# EAGLE design Pedal board (EAGLE 9.4.2)

## Sheet 1 of 5
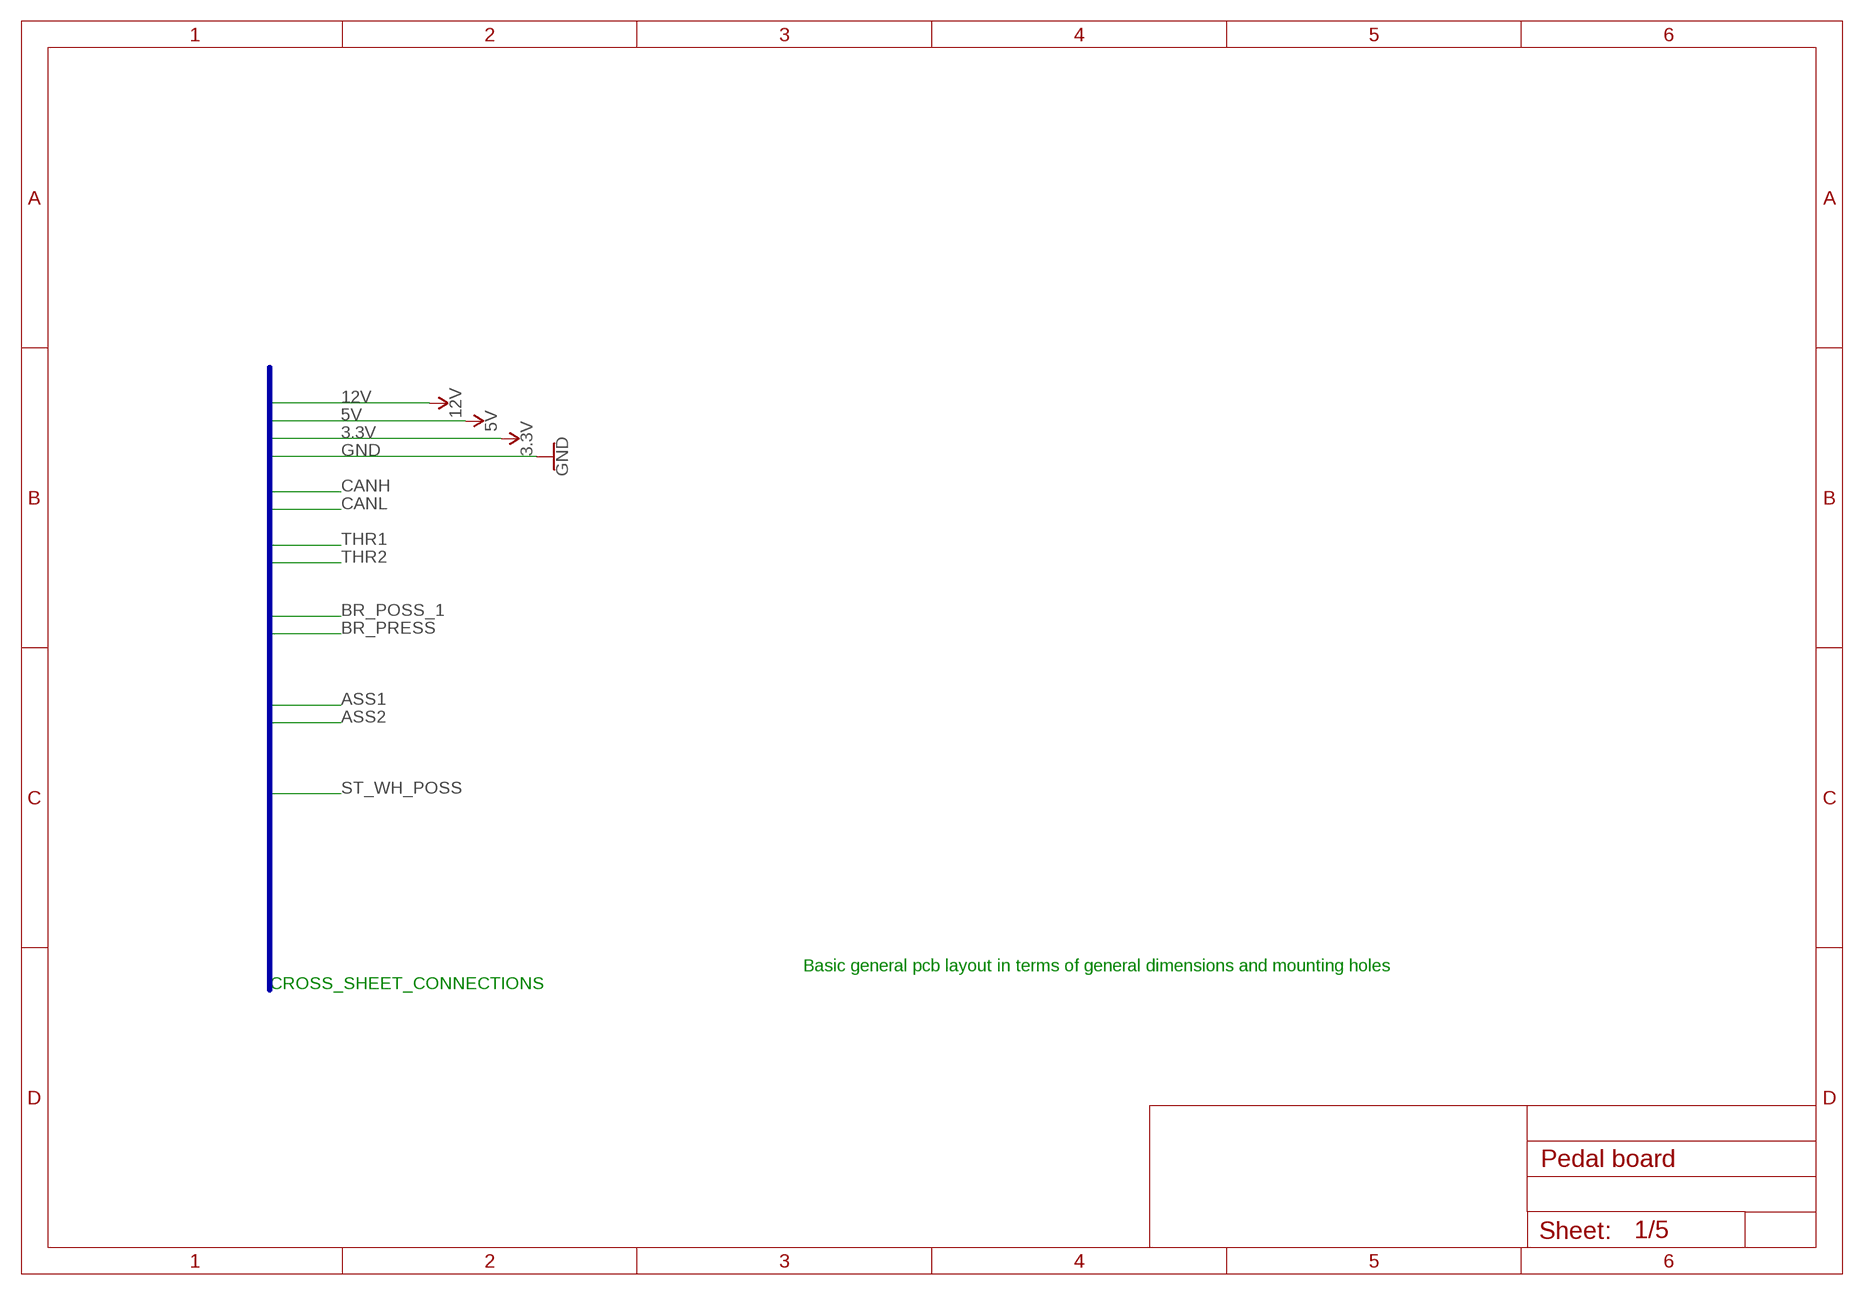
[diagram p0: schematic, sheet 1]

### Buses
3.3V,5V,12V,ASS1,ASS2,BATT_CURRENT,BRAKE_LIGHTS_OUT,BR_POSS,BR_PRESS,CANH,CANL,GND,ST_WH_POSS,THR1,THR2,THR3

### Notes on the sheet
- Basic general pcb layout in terms of general dimensions and mounting holes
- CROSS_SHEET_CONNECTIONS

## Sheet 2 of 5: INPUTS
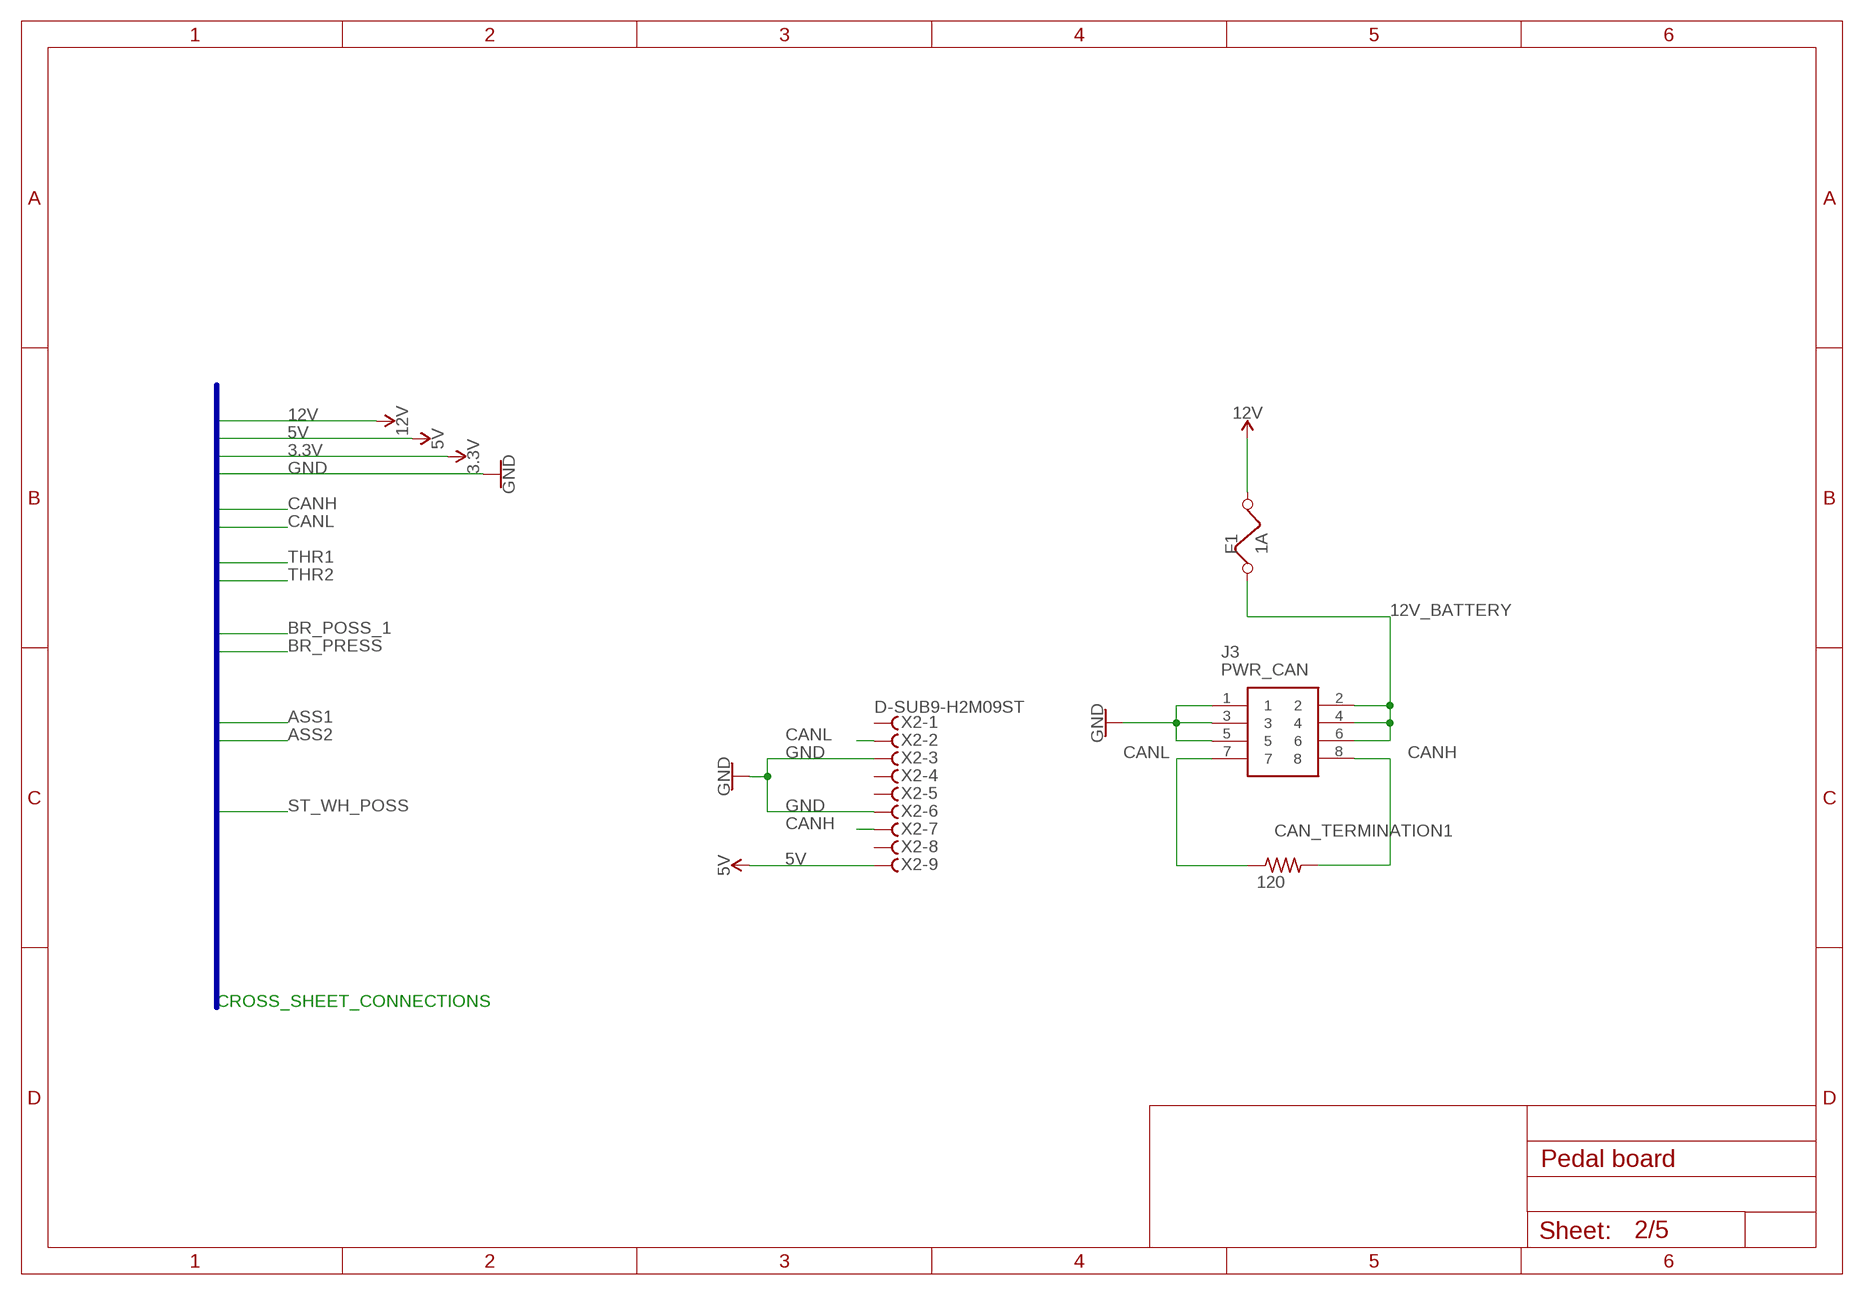
[diagram p1: schematic, sheet 2]

### Parts
CAN_TERMINATION1  120  R-US_R0805  [R0805]
F1  1A  FUSE  [FUSE]
J3  PWR_CAN  T821108A1S100CEU  [HDRV8W64P254_2X4_1778X895X915P]
X2  D-SUB9-H2M09ST  [H2M09ST]

### Nets
5V: X2.9 ; also sheet 1,3,4,5
12V: F1.2 ; also sheet 1,3,4,5
12V_BATTERY: F1.1 J3.2 J3.4 J3.6
CANH: CAN_TERMINATION1.2 J3.8 X2.7 ; also sheet 1,3,4,5
CANL: CAN_TERMINATION1.1 J3.7 X2.2 ; also sheet 1,3,4,5
GND: J3.1 J3.3 J3.5 X2.3 X2.6 ; also sheet 1,3,4,5
Unconnected: X2.1 X2.4 X2.5 X2.8

### Buses
3.3V,5V,12V,ASS1,ASS2,BATT_CURRENT,BRAKE_LIGHTS_OUT,BR_POSS,BR_PRESS,CANH,CANL,GND,ST_WH_POSS,THR1,THR2,THR3

### Notes on the sheet
- CROSS_SHEET_CONNECTIONS

## Sheet 3 of 5: POWER DELIVERY
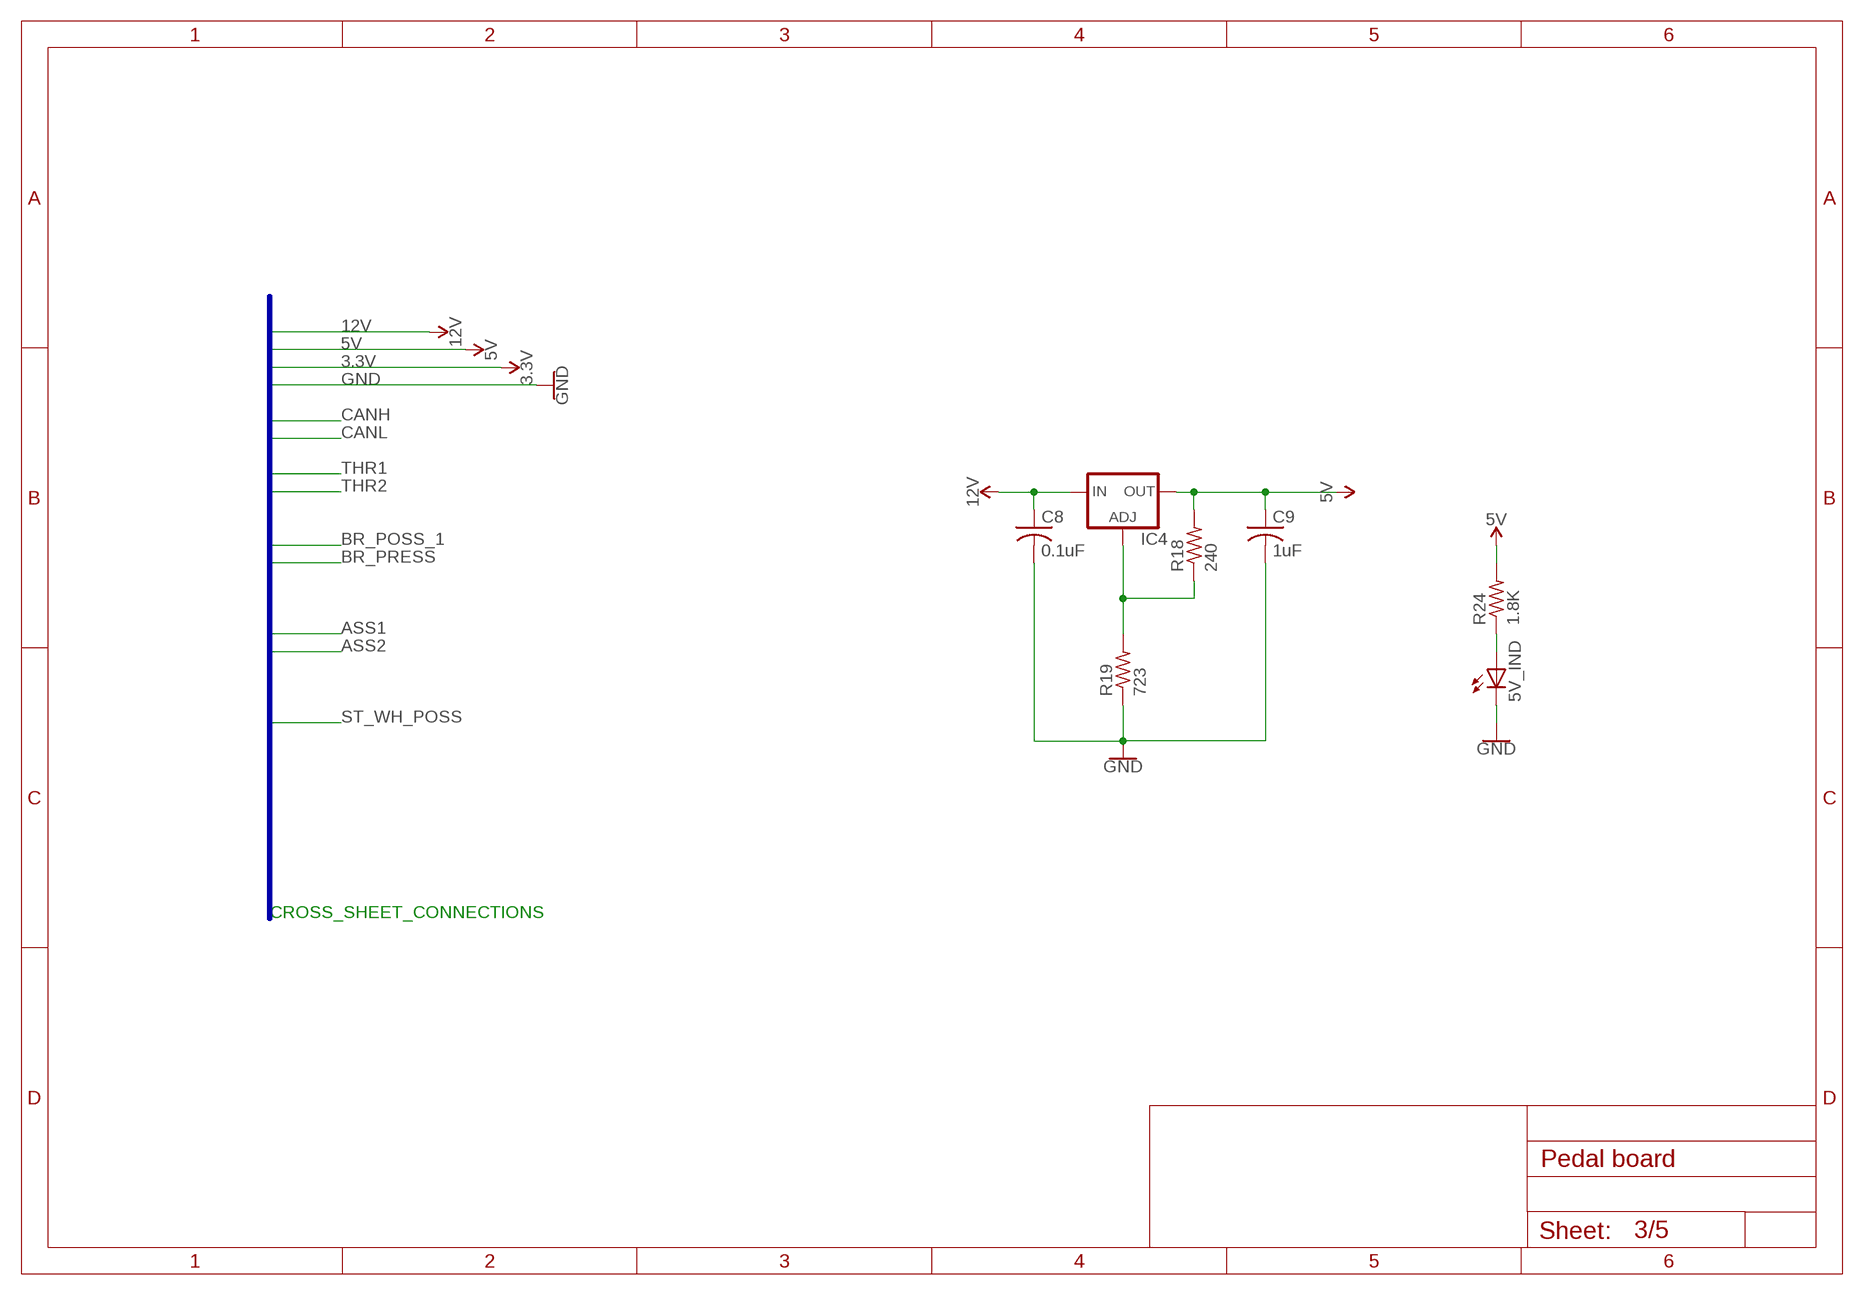
[diagram p2: schematic, sheet 3]

### Parts
5V_IND  LED3MM  [LED3MM]
C8  0.1uF  C-US050-025X075  [C050-025X075]
C9  1uF  C-US050-025X075  [C050-025X075]
IC4  LM317TS  [317TS]
R18  240  R-US_R0805  [R0805]
R19  723  R-US_R0805  [R0805]
R24  1.8K  R-US_R0805  [R0805]

### Nets
5V: C9.1 IC4.2(OUT) R18.2 R24.2 ; also sheet 1,2,4,5
12V: C8.1 IC4.3(IN) ; also sheet 1,2,4,5
GND: 5V_IND.K(C) C8.2 C9.2 R19.1 ; also sheet 1,2,4,5
N$4: 5V_IND.A R24.1
N$26: IC4.1(ADJ) R18.1 R19.2

### Buses
3.3V,5V,12V,ASS1,ASS2,BATT_CURRENT,BRAKE_LIGHTS_OUT,BR_POSS,BR_PRESS,CANH,CANL,GND,ST_WH_POSS,THR1,THR2,THR3

### Notes on the sheet
- CROSS_SHEET_CONNECTIONS

## Sheet 4 of 5: MICROCONTROLLER
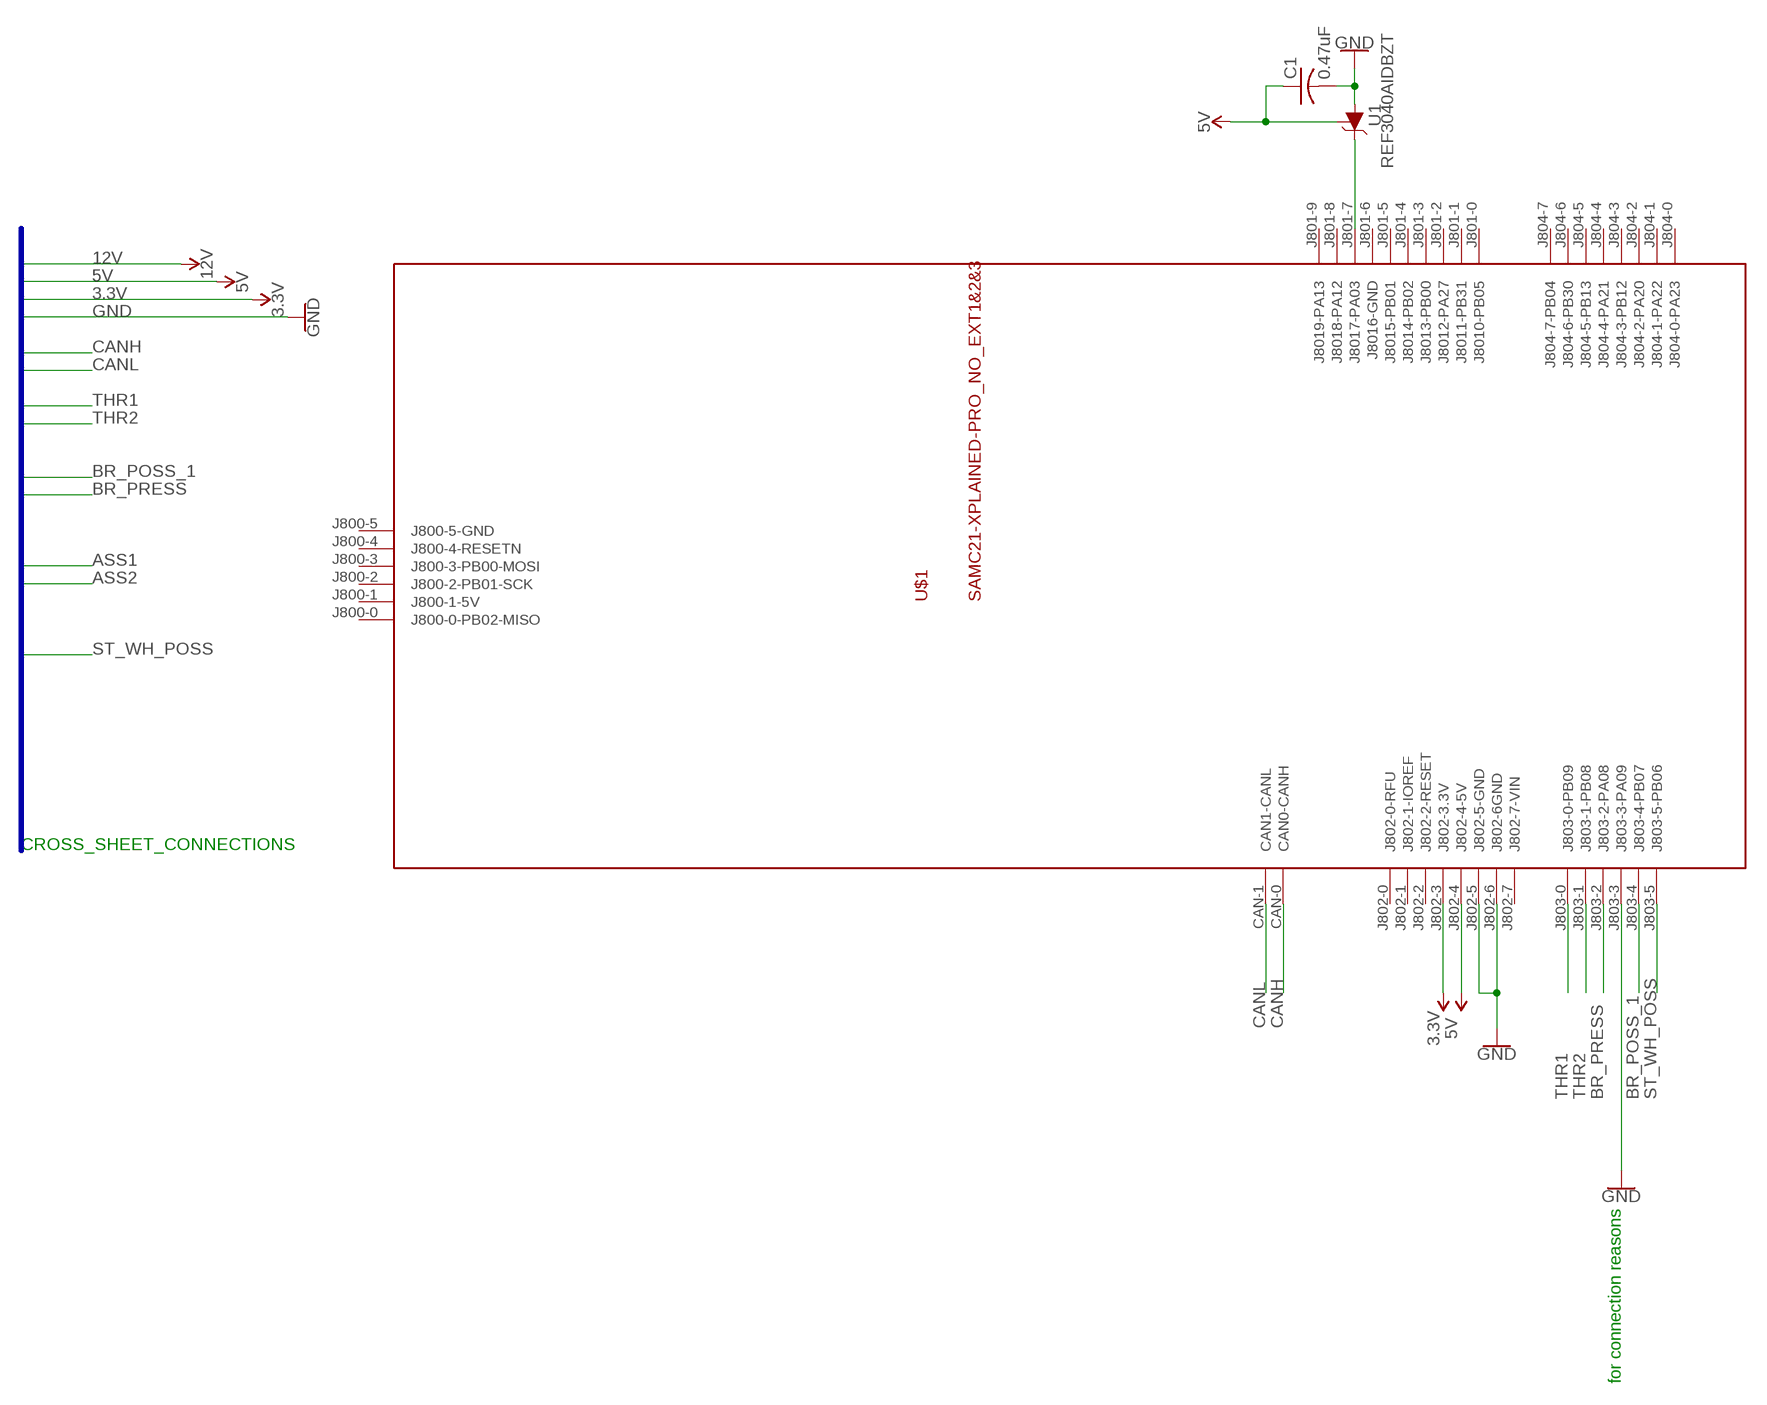
[diagram p3: schematic, sheet 4]

### Parts
C1  0.47uF  C-US050-024X044  [C050-024X044]
U1  REF3040AIDBZT  LM4051  [SOT23-3]
U$1  SAMC21-XPLAINED-PRO_NO_EXT1&2&3  [SAMC21-XPLAINED-PRO_NO_EXT1&2&3]

### Nets
3.3V: U$1.J802-3(J802-3.3V) ; also sheet 1,2,3,5
5V: C1.1 U1.1(ADJ) U$1.J802-4(J802-4-5V) ; also sheet 1,2,3,5
BR_POSS_1: U$1.J803-4(J803-4-PB07) ; also sheet 1,2,3,5
BR_PRESS: U$1.J803-2(J803-2-PA08) ; also sheet 1,2,3,5
CANH: U$1.CAN-0(CAN0-CANH) ; also sheet 1,2,3,5
CANL: U$1.CAN-1(CAN1-CANL) ; also sheet 1,2,3,5
GND: C1.2 U1.3(A) U$1.J802-5(J802-5-GND) U$1.J802-6(J802-6GND) U$1.J803-3(J803-3-PA09) ; also sheet 1,2,3,5
N$12: U1.2(C) U$1.J801-7(J8017-PA03)
ST_WH_POSS: U$1.J803-5(J803-5-PB06) ; also sheet 1,2,3,5
THR1: U$1.J803-0(J803-0-PB09) ; also sheet 1,2,3,5
THR2: U$1.J803-1(J803-1-PB08) ; also sheet 1,2,3,5
Unconnected: U$1.J800-0(J800-0-PB02-MISO) U$1.J800-1(J800-1-5V) U$1.J800-2(J800-2-PB01-SCK) U$1.J800-3(J800-3-PB00-MOSI) U$1.J800-4(J800-4-RESETN) U$1.J800-5(J800-5-GND) U$1.J801-0(J8010-PB05) U$1.J801-1(J8011-PB31) U$1.J801-2(J8012-PA27) U$1.J801-3(J8013-PB00) U$1.J801-4(J8014-PB02) U$1.J801-5(J8015-PB01) U$1.J801-6(J8016-GND) U$1.J801-8(J8018-PA12) U$1.J801-9(J8019-PA13) U$1.J802-0(J802-0-RFU) U$1.J802-1(J802-1-IOREF) U$1.J802-2(J802-2-RESET) U$1.J802-7(J802-7-VIN) U$1.J804-0(J804-0-PA23) U$1.J804-1(J804-1-PA22) U$1.J804-2(J804-2-PA20) U$1.J804-3(J804-3-PB12) U$1.J804-4(J804-4-PA21) U$1.J804-5(J804-5-PB13) U$1.J804-6(J804-6-PB30) U$1.J804-7(J804-7-PB04)

### Buses
3.3V,5V,12V,ASS1,ASS2,BATT_CURRENT,BRAKE_LIGHTS_OUT,BR_POSS,BR_POSS_1,BR_POSS2,BR_PRESS,CANH,CANL,GND,ST_WH_POSS,THR1,THR2,THR3

### Notes on the sheet
- CROSS_SHEET_CONNECTIONS
- for connection reasons

## Sheet 5 of 5: OUTPUTS
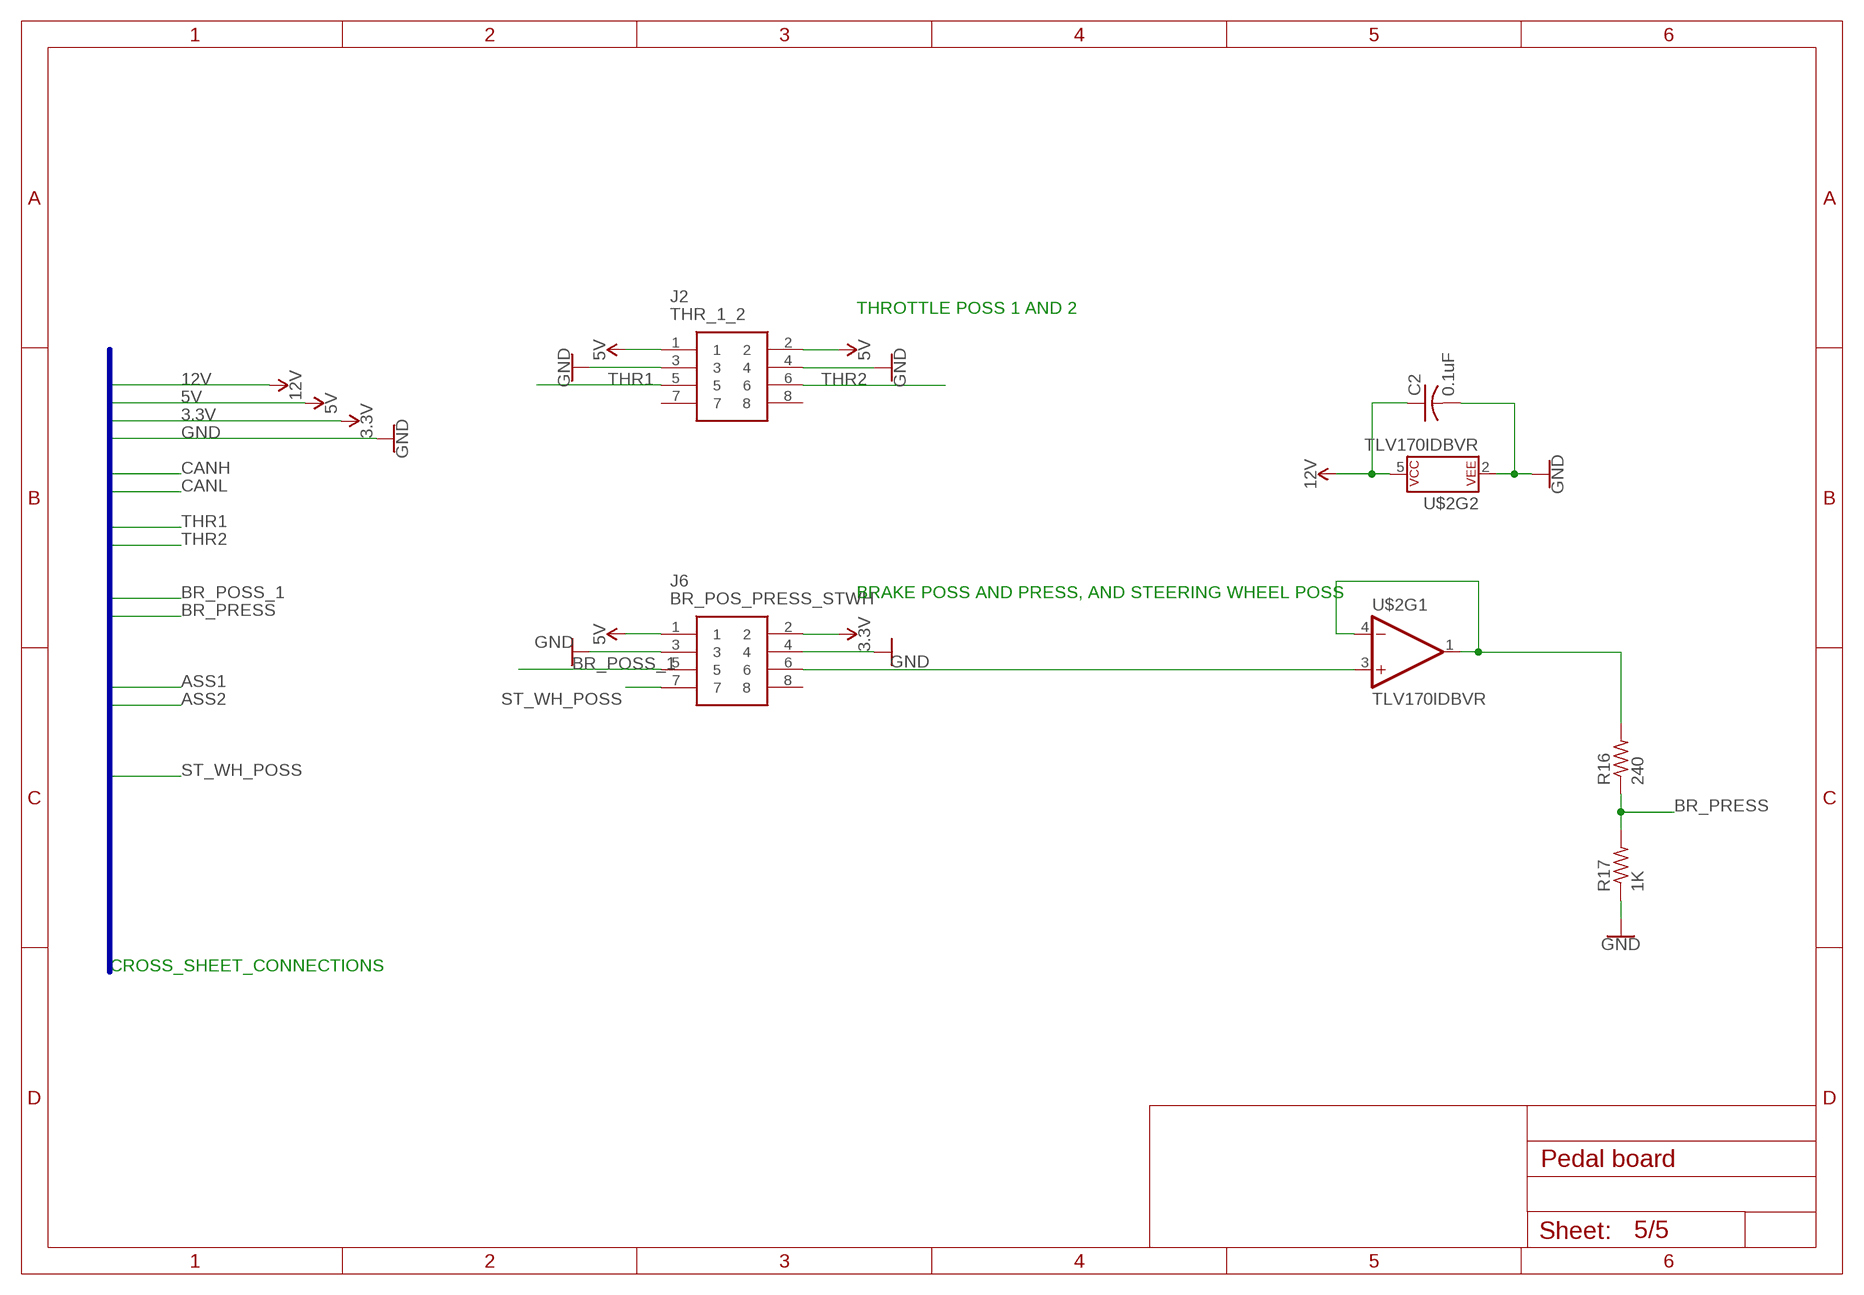
[diagram p4: schematic, sheet 5]

### Parts
C2  0.1uF  C-US050-024X044  [C050-024X044]
J2  THR_1_2  T821108A1S100CEU  [HDRV8W64P254_2X4_1778X895X915P]
J6  BR_POS_PRESS_STWH  T821108A1S100CEU  [HDRV8W64P254_2X4_1778X895X915P]
R16  240  R-US_R0805  [R0805]
R17  1K  R-US_R0805  [R0805]
U$2  TLV170IDBVR  MCP6021T-E/OT  [SOT23-5]

### Nets
3.3V: J6.2 ; also sheet 1,2,3,4
5V: J2.1 J2.2 J6.1 ; also sheet 1,2,3,4
12V: C2.1 U$2.5(P$V+) ; also sheet 1,2,3,4
BR_POSS_1: J6.5 ; also sheet 1,2,3,4
BR_PRESS: R16.1 R17.2 ; also sheet 1,2,3,4
GND: C2.2 J2.3 J2.4 J6.3 J6.4 R17.1 U$2.2(P$V-) ; also sheet 1,2,3,4
N$1: R16.2 U$2.1(OUT) U$2.4(-IN)
N$27: J6.6 U$2.3(+IN)
ST_WH_POSS: J6.7 ; also sheet 1,2,3,4
THR1: J2.5 ; also sheet 1,2,3,4
THR2: J2.6 ; also sheet 1,2,3,4
Unconnected: J2.7 J2.8 J6.8

### Buses
3.3V,5V,12V,ASS1,ASS2,BATT_CURRENT,BRAKE_LIGHTS_OUT,BR_POSS,BR_POSS_1,BR_POSS2,BR_PRESS,CANH,CANL,GND,ST_WH_POSS,THR1,THR2,THR3

### Notes on the sheet
- THROTTLE POSS 1 AND 2
- BRAKE POSS AND PRESS, AND STEERING WHEEL POSS
- CROSS_SHEET_CONNECTIONS

## Library data of the parts
5V_IND = adafruit:LED: LED OSRAM: - CHIPLED LG R971, LG N971, LY N971, LG Q971, LY Q971, LO R971, LY R971 LH N974, LH R974 LS Q976, LO Q976, LY Q976 LO Q996 - Hyper CHIPLED LW Q18S LB Q993, LB Q99A, LB R99A - SideLED LS A670, LO A670, LY A670, LG A670, LP A670 LB A673, LV A673, LT A673, LW A673 LH A674 LY A675 LS A676, LA A676, LO A676, LY A676, LW A676 LS A679, LY A679, LG A679 - Hyper Micro SIDELED® LS Y876, LA Y876, LO Y876, LY Y876 LT Y87S - SmartLED LW L88C, LW L88S LB L89C, LB L89S, LG L890 LS L89K, LO L89K, LY L89K LS L896, LA L896, LO L896, LY L896 - TOPLED LS T670, LO T670, LY T670, LG T670, LP T670 LSG T670, LSP T670, LSY T670, LOP T670, LYG T670 LG T671, LOG T671, LSG T671 LB T673, LV T673, LT T673, LW T673 LH T674 LS T676, LA T676, LO T676, LY T676, LB T676, LH T676, LSB T676, LW T676 LB T67C, LV T67C, LT T67C, LS T67K, LO T67K, LY T67K, LW E67C LS E67B, LA E67B, LO E67B, LY E67B, LB E67C, LV E67C, LT E67C LW T67C LS T679, LY T679, LG T679 LS T770, LO T770, LY T770, LG T770, LP T770 LB T773, LV T773, LT T773, LW T773 LH T774 LS E675, LA E675, LY E675, LS T675 LS T776, LA T776, LO T776, LY T776, LB T776 LHGB T686 LT T68C, LB T68C - Hyper Mini TOPLED® LB M676 - Mini TOPLED Santana® LG M470 LS M47K, LO M47K, LY M47K Source: http://www.osram.convergy.de/
C1 C2 C8 C9 = adafruit:C-US: CAPACITOR, American symbol
CAN_TERMINATION1 R16-R19 R24 = adafruit:R-US_: RESISTOR, American symbol
F1 = special:FUSE: FUSE 5 x 20 mm
IC4 = v-reg:LM317TS: VOLTAGE REGULATOR
J2 J3 J6 = T821108A1S100CEU:T821108A1S100CEU: HEADER, VERTICAL, 2.54MM, 8WAY Amphenol T821 Series, 2.54mm Pitch 8 Way 2 Row Straight PCB Header, Solder Termination, 3A Source: Datasheet <http://uk.rs-online.com/web/p/products/1702738>; DESCRIPTION: HEADER, VERTICAL, 2.54MM, 8WAY Amphenol T821 Series, 2.54mm Pitch 8 Way 2 Row Straight PCB Header, Solder Termination, 3A; HEIGHT: 9.15mm; MANUFACTURER_NAME: Amphenol; MANUFACTURER_PART_NUMBER: T821108A1S100CEU; RS_PART_NUMBER: 1702738
U1 = SparkFun-DiscreteSemi:LM4051: Adjustable Shunt Voltage Reference SOT-23 package without need for external capacitor. Adjustable from 1.24V to 10V. 60µA to 12mA SparkFun Products: SparkFun SparkPunk Sound Kit <https://www.sparkfun.com/products/11177> SparkFun ESP8266 Thing <https://www.sparkfun.com/products/13231>; PROD_ID: IC-13134; VALUE: LM4051
U$1 = Oxford Uni Racing Custom Blueprints:SAMC21-XPLAINED-PRO_NO_EXT1&2&3
U$2 = SparkFun-IC-Amplifiers:MCP6021: MCP6021T-E/OT OP AMP Rail-to-rail input/output op-amp with 10 MHz bandwidth. SparkFun Products ZX Distance and Gesture Sensor <https://www.sparkfun.com/products/12780> (SEN-12780); PROD_ID: IC-12504; VALUE: MCP6021T
X2 = con-thomas-betts:D-SUB9-: D-Subminiatur Connector Source: Electronioc Interconnects European Edition 1998; OC_FARNELL: unknown; OC_NEWARK: unknown

## Board
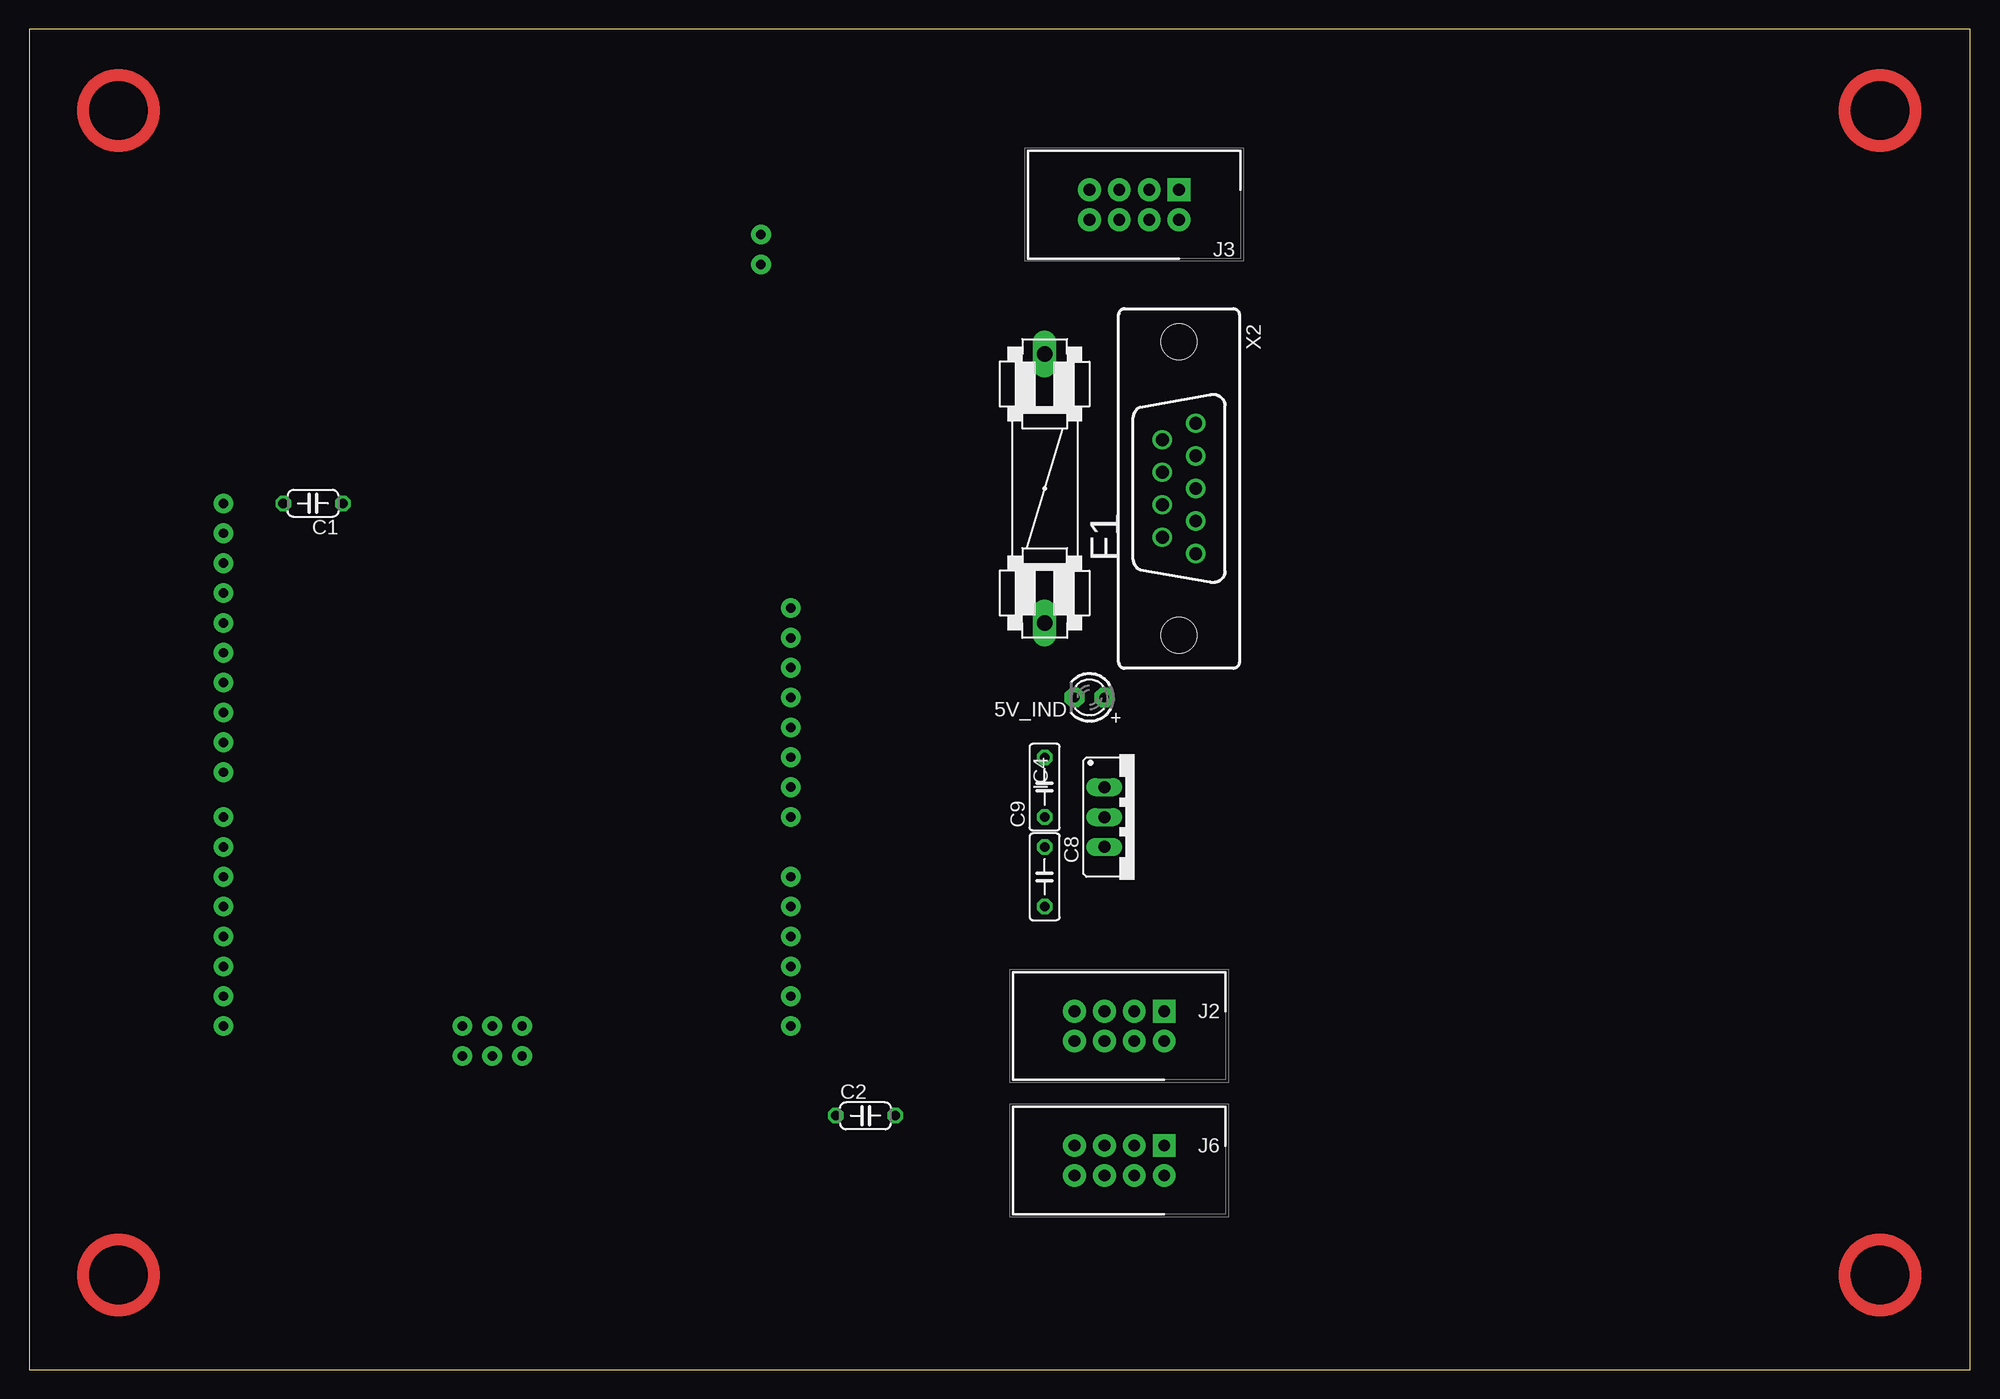
[diagram p5: board, top side]
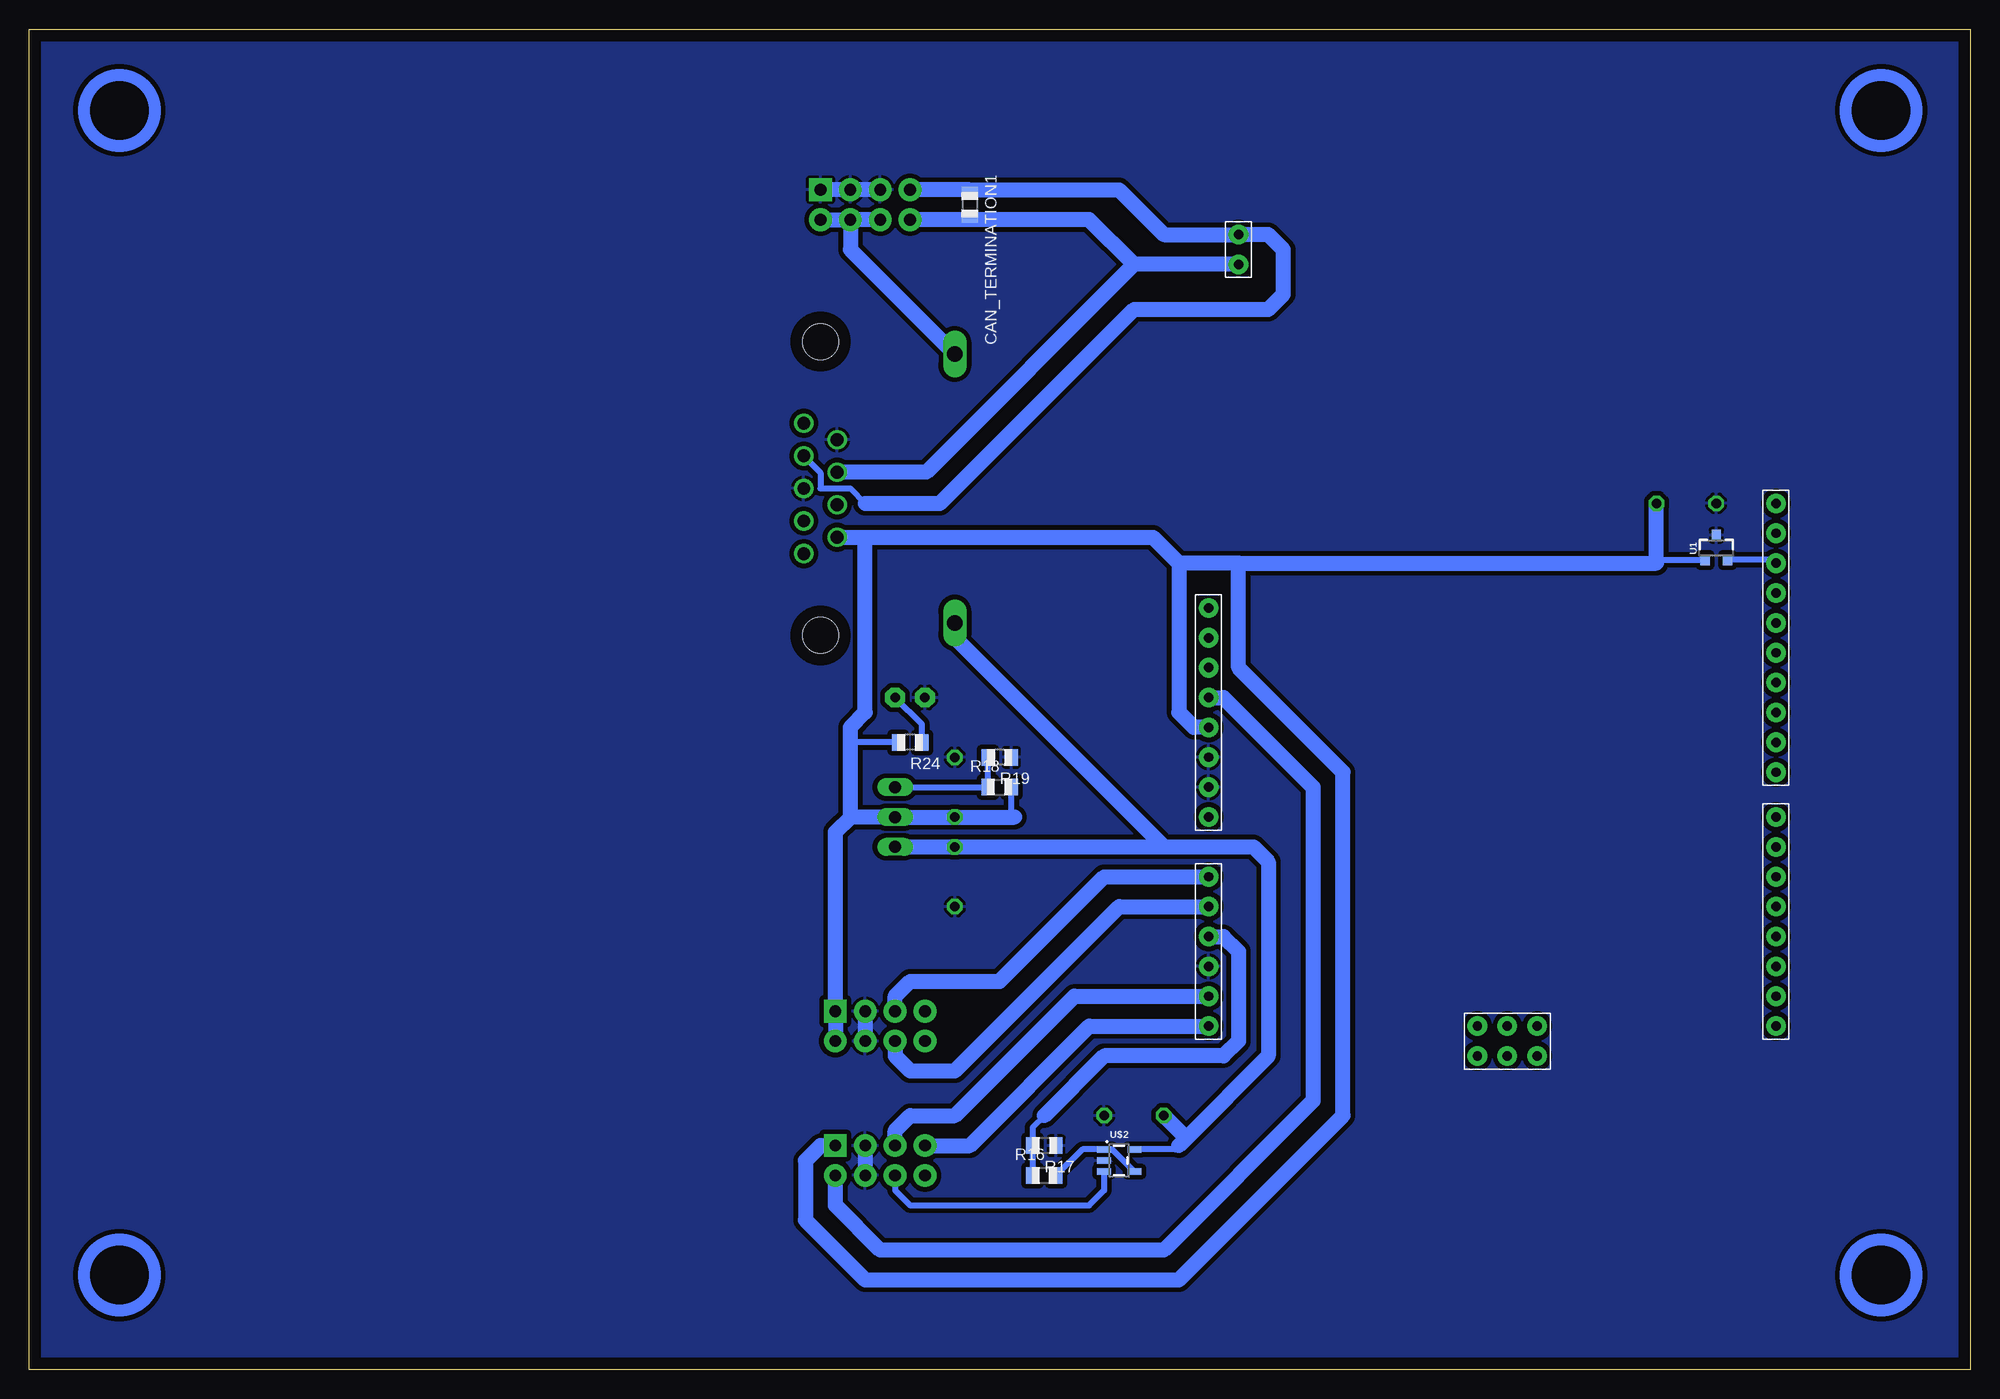
[diagram p6: board, bottom side, seen from below]

Size 165.08 x 113.97 mm. Coordinates in mm from the lower left corner, seen from the top.
Outline: 0,0 165.08,0 165.08,113.97 0,113.97 0,0
Copper layers (1*16): Top 0.035mm / dielectric 1.5mm / Bottom 0.035mm
Design rules "default *": minimum track width 6mil, minimum drill 0.35mm, track to track 16mil, track to pad 16mil, pad to pad 16mil, via to via 16mil, smd to smd 16mil, copper to edge 40mil, drill to drill 6mil, minimum pad ring 10mil, minimum via ring 8mil, stop-mask expansion 4mil, vias tented up to drill 0mil, thermal gap 10mil

### Footprints (pad centres in the part's own frame; a part is rotated, then mirrored left to right if it is on the bottom)
LED3MM = drill 0.813 pad 1.676 octagon: A -1.27,0; K 1.27,0
C050-024X044 = drill 0.813 octagon: 1 -2.54,0; 2 2.54,0
C050-025X075 = drill 0.813 octagon: 1 -2.54,0; 2 2.54,0
R0805 = smd 1.1 x 1.4: 1 -1,0; 2 1,0
FUSE = drill 1.321 long: 1 -11.43,0; 2 11.43,0
317TS = drill 1.016 long: 1 -2.54,-2.54; 2 0,-2.54; 3 2.54,-2.54
HDRV8W64P254_2X4_1778X895X915P = drill 1 pad 1.93 square: 1 0,0 | drill 1 pad 1.93: 2 0,2.54; 3 2.54,0; 4 2.54,2.54; 5 5.08,0; 6 5.08,2.54; 7 7.62,0; 8 7.62,2.54
SOT23-3 = smd 0.8 x 0.9: 1 -0.95,-1; 2 0.95,-1; 3 0,1.1
SAMC21-XPLAINED-PRO_NO_EXT1&2&3 = drill 0.8 pad 1.676: CAN-0 2.54,64.77; CAN-1 2.54,67.31; J800-0 27.94,0; J800-1 27.94,-2.54; J800-2 25.4,0; J800-3 25.4,-2.54; J800-4 22.86,0; J800-5 22.86,-2.54; J801-0 48.26,21.59; J801-1 48.26,24.13; J801-2 48.26,26.67; J801-3 48.26,29.21; J801-4 48.26,31.75; J801-5 48.26,34.29; J801-6 48.26,36.83; J801-7 48.26,39.37; J801-8 48.26,41.91; J801-9 48.26,44.45; J802-0 0,35.56; J802-1 0,33.02; J802-2 0,30.48; J802-3 0,27.94; J802-4 0,25.4; J802-5 0,22.86; J802-6 0,20.32; J802-7 0,17.78; J803-0 0,12.7; J803-1 0,10.16; J803-2 0,7.62; J803-3 0,5.08; J803-4 0,2.54; J803-5 0,0; J804-0 48.26,0; J804-1 48.26,2.54; J804-2 48.26,5.08; J804-3 48.26,7.62; J804-4 48.26,10.16; J804-5 48.26,12.7; J804-6 48.26,15.24; J804-7 48.26,17.78
SOT23-5 = smd 0.55 x 1.2: 1 -0.95,-1.3; 2 0,-1.3; 3 0.95,-1.3; 4 0.95,1.3; 5 -0.95,1.3
H2M09ST = drill 1.092: 1 -5.537,1.422; 2 -2.769,1.422; 3 0,1.422; 4 2.769,1.422; 5 5.537,1.422; 6 -4.153,-1.422; 7 -1.384,-1.422; 8 1.384,-1.422; 9 4.153,-1.422 | hole 3.048: -12.497,0; 12.497,0

### Placement (x,y rotation side)
5V_IND  90.17,57.15 180 top
C1  24.13,73.66 180 top
C2  71.12,21.59 0 top
C8  86.36,41.91 270 top
C9  86.36,49.53 90 top
CAN_TERMINATION1  85.09,99.06 270 bottom
F1  86.36,74.93 270 top
IC4  93.98,46.99 270 top
J2  96.52,30.48 180 top
J3  97.79,100.33 180 top
J6  96.52,19.05 180 top
R16  78.74,16.51 0 bottom
R17  78.74,19.05 180 bottom
R18  82.55,49.53 0 bottom
R19  82.55,52.07 180 bottom
R24  90.17,53.34 180 bottom
U1  21.59,69.85 0 bottom
U$1  64.77,29.21 0 bottom
U$2  72.39,17.78 270 bottom
X2  97.79,74.93 270 top

### Tracks (layer width: path | path; a pad name or v marks a point on that pad's centre or on a via)
3.3V
  Bottom 1.27: U$1.J802-3 63.5,57.15 55.88,49.53 55.88,22.86 68.58,10.16 92.71,10.16 96.52,13.97 J6.2
5V
  Bottom 0.508: 81.28,46.99 81.55,47.26 R18.2 | R24.2 95.25,53.34 | 26.67,68.58 26.4,68.85 U1.1
  Bottom 1.27: 81.28,46.99 C9.1 IC4.2 95.25,46.99 | J2.2 J2.1 96.52,45.72 95.25,46.99 | X2.9 93.98,70.78 | 95.25,46.99 95.25,53.34 95.25,54.61 93.98,55.88 93.98,70.78 | J6.1 97.79,19.05 99.06,17.78 99.06,12.7 93.98,7.62 67.31,7.62 53.34,21.59 53.34,50.8 62.23,59.69 62.23,68.58 | U$1.J802-4 66.04,54.61 67.31,55.88 67.31,68.58 | 62.23,68.58 67.31,68.58 | 67.31,68.58 69.51,70.78 93.98,70.78 | 62.23,68.58 26.67,68.58 C1.1
12V
  Bottom 0.508: 67.31,19.05 67.63,18.73 U$2.5
  Bottom 1.27: IC4.3 C8.1 68.58,44.45 | F1.2 86.36,62.23 68.58,44.45 | 68.58,44.45 60.96,44.45 59.69,43.18 59.69,26.67 66.67,19.68 | 66.67,19.68 67.31,19.05 | C2.1 66.67,19.68
12V_BATTERY
  Bottom 1.27: J3.6 J3.4 | J3.2 J3.4 | J3.4 95.25,95.25 F1.1
BR_POSS_1
  Bottom 1.27: J6.5 91.44,20.32 90.17,21.59 86.36,21.59 76.2,31.75 U$1.J803-4
BR_PRESS
  Bottom 0.508: 78.74,21.59 79.74,20.59 R17.2 R16.1
  Bottom 1.27: U$1.J803-2 63.5,36.83 62.23,35.56 62.23,27.94 63.5,26.67 73.66,26.67 78.74,21.59
CANH
  Bottom 0.508: CAN_TERMINATION1.2 85.09,97.79
  Bottom 1.27: J3.8 85.09,97.79 74.93,97.79 71.12,93.98 | X2.7 88.79,76.31 71.12,93.98 | U$1.CAN-0 71.12,93.98
CANL
  Bottom 0.508: CAN_TERMINATION1.1 85.09,100.33 | X2.2 97.79,76.28 97.79,74.93 95.25,74.93 93.98,73.66
  Bottom 1.27: J3.7 85.09,100.33 72.39,100.33 68.58,96.52 U$1.CAN-1 59.69,96.52 58.42,95.25 58.42,91.44 59.69,90.17 71.12,90.17 87.63,73.66 93.98,73.66
GND
  Bottom 1.27: J3.5 J3.3 J3.1 | J2.3 J2.4 | J6.3 J6.4
  pour Bottom (isolate 0.406): 0,114.3 0,0 165.1,0 165.1,114.3
N$1
  Bottom 0.508: U$2.4 72.99,18.73 U$2.1 75.52,18.73 R16.2
N$4
  Bottom 0.508: R24.1 89.17,54.88 5V_IND.A
N$12
  Bottom 0.508: U$1.J801-7 16.78,68.85 U1.2
N$26
  Bottom 0.508: IC4.1 R18.1 R19.2
N$27
  Bottom 0.508: J6.6 91.44,15.24 90.17,13.97 74.93,13.97 73.66,15.24 73.66,16.8 U$2.3
ST_WH_POSS
  Bottom 1.27: J6.7 85.09,19.05 74.93,29.21 U$1.J803-5
THR1
  Bottom 1.27: J2.5 91.44,31.75 90.17,33.02 82.55,33.02 73.66,41.91 U$1.J803-0
THR2
  Bottom 1.27: J2.6 91.44,26.67 90.17,25.4 86.36,25.4 72.39,39.37 U$1.J803-1
(copper drawn outside any net)
  shapes: Bottom circle x4, Top circle x4